# Altium schematic sheet R14FANEXT_ok.SchDoc
size A4
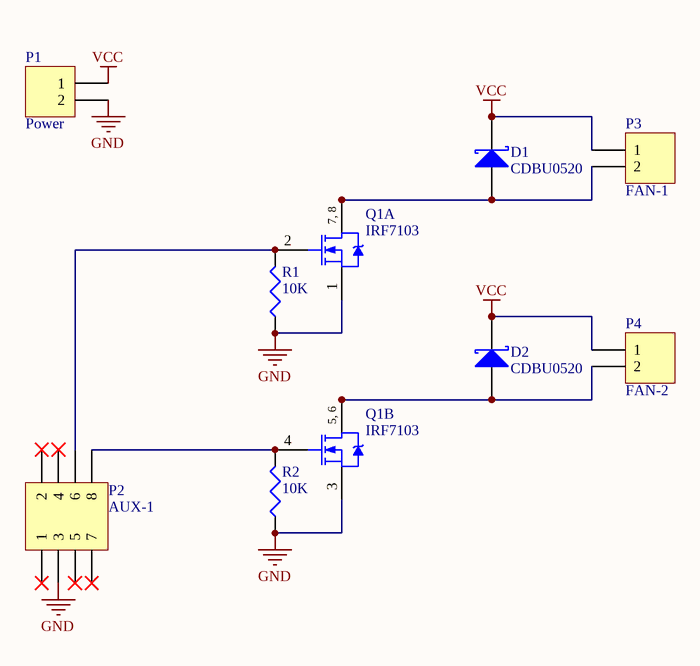
[diagram p0: R14FANEXT_ok.SchDoc]

## Parts
D1  CDBU0520  [DIOM1709X09N]
D2  CDBU0520  [DIOM1709X09N]
P1  Power  [HDR1X2]
P2  AUX-1  [HDR2X4]
P3  FAN-1  [HDR1X2]
P4  FAN-2  [HDR1X2]
Q1  IRF7103  [SO-8_N]  (parts A,B of 2)
R1  value 10K  [J1-0603]  (hidden comment: Res3)
R2  value 10K  [J1-0603]  (hidden comment: Res3)

## Nets
GND: P1.2 P2.3 Q1.1(S) Q1.3(S) R1.1 R2.1
VCC: D1.2(K) D2.2(K) P1.1 P3.1 P4.1
NetD1_1: D1.1(A) P3.2 Q1.7(D) Q1.8(D)
NetD2_1: D2.1(A) P4.2 Q1.5(D) Q1.6(D)
NetP2_6: P2.6 Q1.2(G) R1.2
NetP2_8: P2.8 Q1.4(G) R2.2

Not connected (* = marked no-connect by the designer): P2 1* 2* 4* 5* 7*

## Notes on the sheet
- (in symbol IRF7103, part A) 7, 8
- (in symbol IRF7103, part B) 5, 6

## Library data of the parts
D1 D2 = D Schottky: Schottky Diode; Published: 8-Jun-2000; LatestRevisionDate: 17-Jul-2002; LatestRevisionNote: Re-released for DXP Platform.; PackageReference: SMB; Publisher: Altium Limited; PackageDescription: DO-214-AA/SMB; 2 C-Bend Leads; Body 5.3 x 3.6 mm, inc. leads (LxW); Code_JEDEC: DO-214-AA
P1 P3 P4 = Header 2: Header, 2-Pin; LatestRevisionDate: 17-Jul-2002; LatestRevisionNote: Re-released for DXP Platform.; Publisher: Altium Limited
P2 = Header 4X2: Header, 4-Pin, Dual row; LatestRevisionDate: 17-Jul-2002; LatestRevisionNote: Re-released for DXP Platform.; Publisher: Altium Limited
Q1 = IRF7103: HEXFET Power MOSFET; Published: 8-Jun-2000; LatestRevisionDate: 13-Apr-2006; LatestRevisionNote: IPC-7351 Footprint Added.; DatasheetVersion: Aug-1997; PackageVersion: Feb-2001; PackageReference: SO-8; Publisher: Altium Limited; PackageDescription: 8-Pin Plastic Small Outline Integrated Circuit 1.27 mm Pitch; Code_JEDEC: MS-012-AA; Code_IPC: SOIC127P600-8; ComponentLink1Description: Manufacturer Link; ComponentLink1URL: http://www.irf.com/; ComponentLink2Description: Datasheet; ComponentLink2URL: http://www.irf.com/product-info/datasheets/data/irf7103.pdf
R1 R2 = Res3: Resistor; Published: 8-Jun-2000; LatestRevisionDate: 29-May-2009; LatestRevisionNote: IPC-7351 Footprint Added.; PackageReference: J1-0603; Publisher: Altium Limited; PackageDescription: Chip Resistor